# EAGLE design ne5044_emulator (EAGLE 9.2.0)
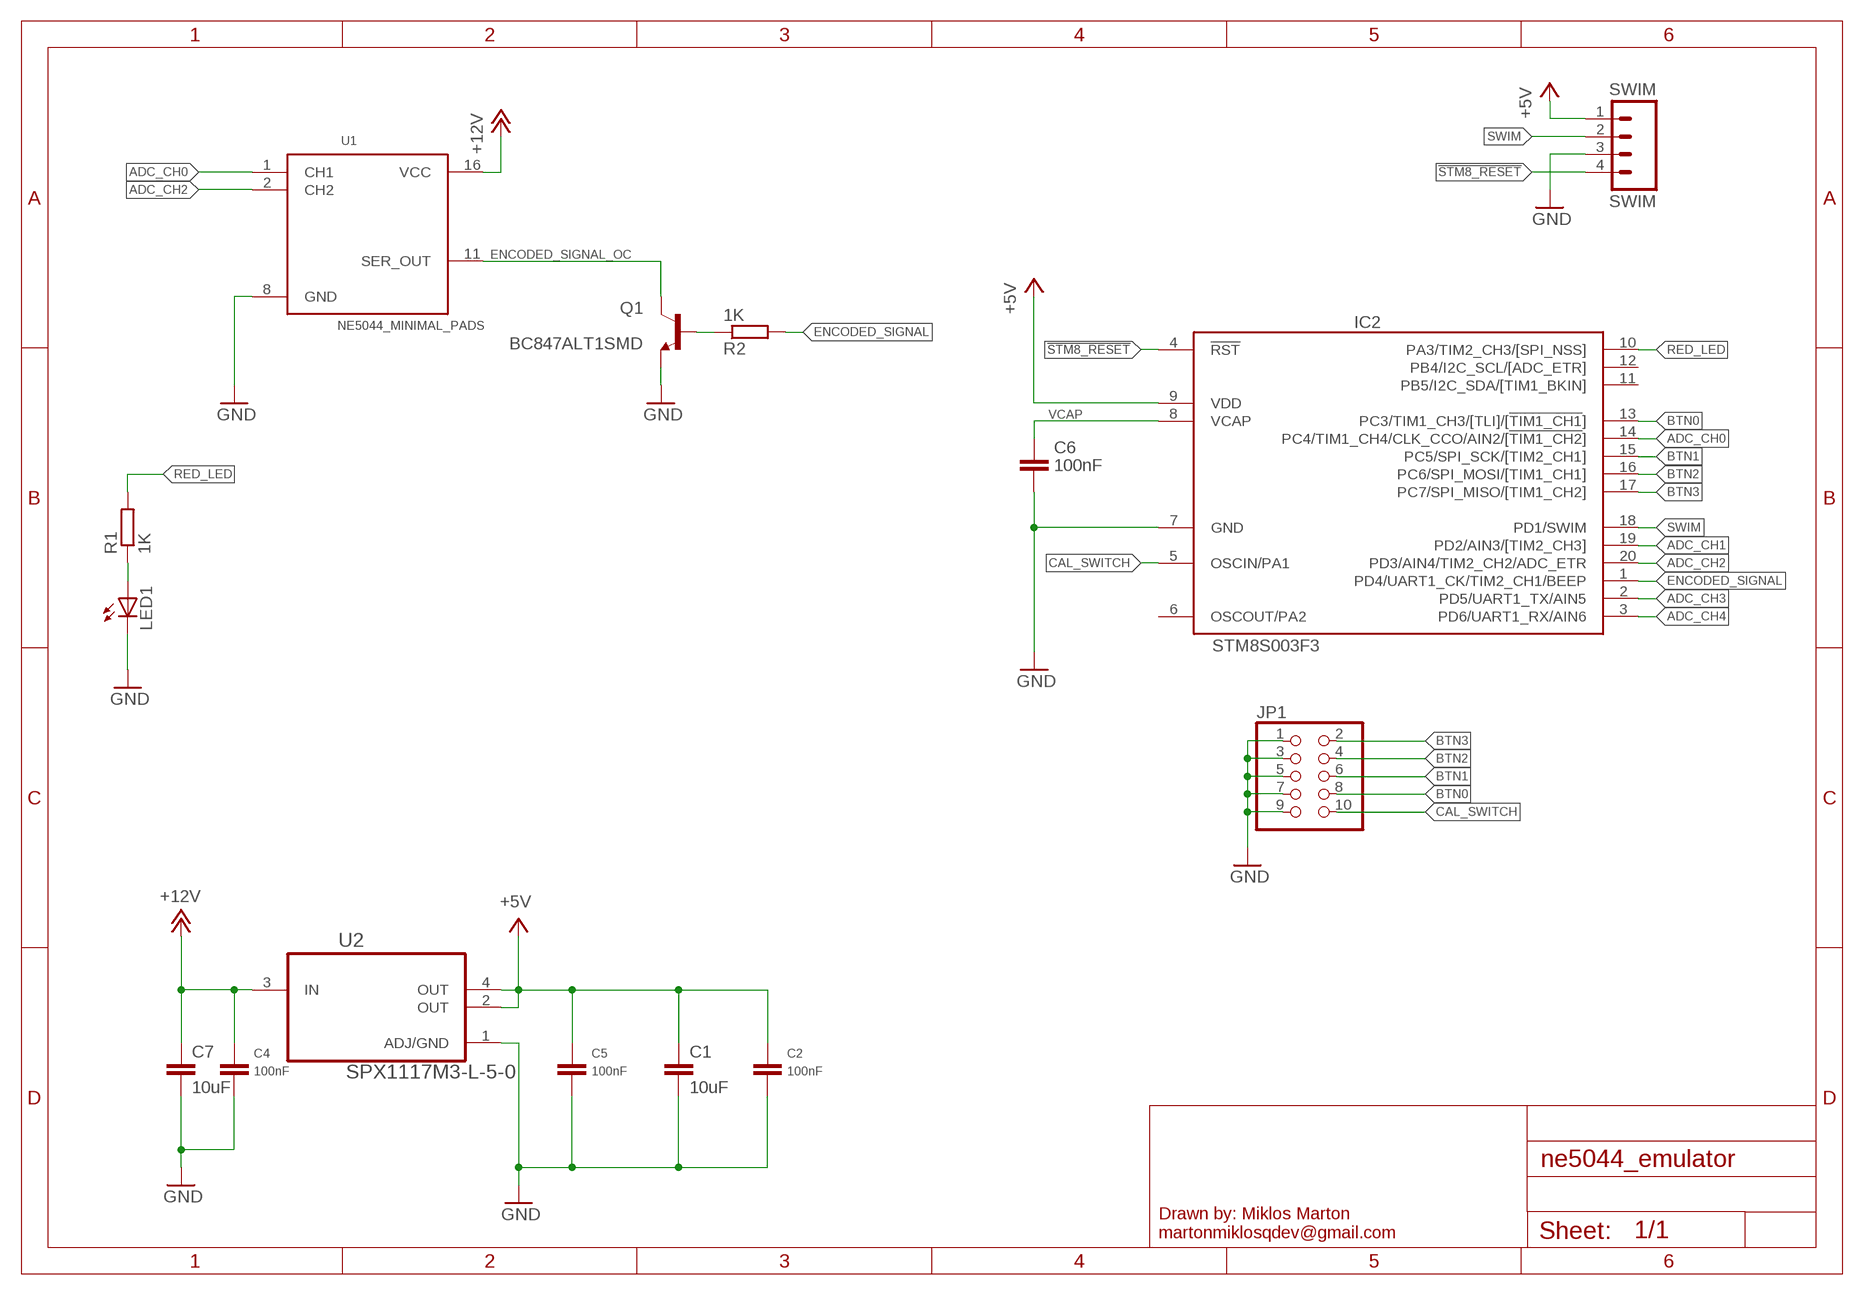
[diagram p0: schematic, sheet 1]

## Parts
C1  10uF  C-EUC0805  [C0805]
C2  100nF  C-EUC0603K  [C0603K]
C4  100nF  C-EUC0603K  [C0603K]
C5  100nF  C-EUC0603K  [C0603K]
C6  100nF  C-EUC0603  [C0603]
C7  10uF  C-EUC0805  [C0805]
IC2  STM8S003F3  [TSSOP20]
JP1  PINHD-2X5  [2X05]
LED1  LEDCHIP-LED0603  [CHIP-LED0603]
Q1  BC847ALT1SMD  [SOT23]
R1  1K  R-EU_R0603  [R0603]
R2  1K  R-EU_R0603  [R0603]
SWIM  SWIM  M041.27MM  [1X04-1.27MM]
U1  NE5044_MINIMAL_PADS  [DIL16_MINIMAL_PADS_FOR_NE5044]
U2  SPX1117M3-L-5-0  LM1117MP-ADJ  [SOT230P696X180-4N]

## Nets
!STM8_RESET: IC2.4(!RST) SWIM.4
+5V: C1.1 C2.1 C5.1 IC2.9(VDD) SWIM.1 U2.2(OUT) U2.4(OUT)
+12V: C4.1 C7.1 U1.16(VCC) U2.3(IN)
ADC_CH0: IC2.14(PC4/TIM1_CH4/CLK_CCO/AIN2/[!TIM1_CH2!]) U1.1(CH1)
ADC_CH1: IC2.19(PD2/AIN3/[TIM2_CH3])
ADC_CH2: IC2.20(PD3/AIN4/TIM2_CH2/ADC_ETR) U1.2(CH2)
ADC_CH3: IC2.2(PD5/UART1_TX/AIN5)
ADC_CH4: IC2.3(PD6/UART1_RX/AIN6)
BTN0: IC2.13(PC3/TIM1_CH3/[TLI]/[!TIM1_CH1!]) JP1.8
BTN1: IC2.15(PC5/SPI_SCK/[TIM2_CH1]) JP1.6
BTN2: IC2.16(PC6/SPI_MOSI/[TIM1_CH1]) JP1.4
BTN3: IC2.17(PC7/SPI_MISO/[TIM1_CH2]) JP1.2
CAL_SWITCH: IC2.5(OSCIN/PA1) JP1.10
ENCODED_SIGNAL: IC2.1(PD4/UART1_CK/TIM2_CH1/BEEP) R2.2
ENCODED_SIGNAL_OC: Q1.3(C) U1.11(SER_OUT)
GND: C1.2 C2.2 C4.2 C5.2 C6.2 C7.2 IC2.7(GND) JP1.1 JP1.3 JP1.5 JP1.7 JP1.9 LED1.C Q1.2(E) SWIM.3 U1.8(GND) U2.1(ADJ/GND)
N$1: LED1.A R1.1
N$2: Q1.1(B) R2.1
RED_LED: IC2.10(PA3/TIM2_CH3/[SPI_NSS]) R1.2
SWIM: IC2.18(PD1/SWIM) SWIM.2
VCAP: C6.1 IC2.8(VCAP)
Unconnected: IC2.6(OSCOUT/PA2) IC2.11(PB5/I2C_SDA/[TIM1_BKIN]) IC2.12(PB4/I2C_SCL/[ADC_ETR])

## Library data of the parts
C1 C7 = rcl:C-EU: CAPACITOR, European symbol
C2 C4-C6 = rcl:C-EU: CAPACITOR, European symbol; OC_LOMEX: 82-06-23
IC2 = stm8:STM8S003: Value line, 16 MHz STM8S 8-bit MCU, 8 Kbytes Flash, 128 bytes data EEPROM, 10-bit ADC, 3 timers, UART, SPI, I2C
JP1 = pinhead:PINHD-2X5: PIN HEADER
LED1 = led:LED: LED OSRAM: - CHIPLED LG R971, LG N971, LY N971, LG Q971, LY Q971, LO R971, LY R971 LH N974, LH R974 LS Q976, LO Q976, LY Q976 LO Q996 - Hyper CHIPLED LW Q18S LB Q993, LB Q99A, LB R99A - SideLED LS A670, LO A670, LY A670, LG A670, LP A670 LB A673, LV A673, LT A673, LW A673 LH A674 LY A675 LS A676, LA A676, LO A676, LY A676, LW A676 LS A679, LY A679, LG A679 - Hyper Micro SIDELED® LS Y876, LA Y876, LO Y876, LY Y876 LT Y87S - SmartLED LW L88C, LW L88S LB L89C, LB L89S, LG L890 LS L89K, LO L89K, LY L89K LS L896, LA L896, LO L896, LY L896 - TOPLED LS T670, LO T670, LY T670, LG T670, LP T670 LSG T670, LSP T670, LSY T670, LOP T670, LYG T670 LG T671, LOG T671, LSG T671 LB T673, LV T673, LT T673, LW T673 LH T674 LS T676, LA T676, LO T676, LY T676, LB T676, LH T676, LSB T676, LW T676 LB T67C, LV T67C, LT T67C, LS T67K, LO T67K, LY T67K, LW E67C LS E67B, LA E67B, LO E67B, LY E67B, LB E67C, LV E67C, LT E67C LW T67C LS T679, LY T679, LG T679 LS T770, LO T770, LY T770, LG T770, LP T770 LB T773, LV T773, LT T773, LW T773 LH T774 LS E675, LA E675, LY E675, LS T675 LS T776, LA T776, LO T776, LY T776, LB T776 LHGB T686 LT T68C, LB T68C - Hyper Mini TOPLED® LB M676 - Mini TOPLED Santana® LG M470 LS M47K, LO M47K, LY M47K Source: http://www.osram.convergy.de LUXEON: - LUMILED® LXK2-PW12-R00, LXK2-PW12-S00, LXK2-PW14-U00, LXK2-PW14-V00 LXK2-PM12-R00, LXK2-PM12-S00, LXK2-PM14-U00 LXK2-PE12-Q00, LXK2-PE12-R00, LXK2-PE12-S00, LXK2-PE14-T00, LXK2-PE14-U00 LXK2-PB12-K00, LXK2-PB12-L00, LXK2-PB12-M00, LXK2-PB14-N00, LXK2-PB14-P00, LXK2-PB14-Q00 LXK2-PR12-L00, LXK2-PR12-M00, LXK2-PR14-Q00, LXK2-PR14-R00 LXK2-PD12-Q00, LXK2-PD12-R00, LXK2-PD12-S00 LXK2-PH12-R00, LXK2-PH12-S00 LXK2-PL12-P00, LXK2-PL12-Q00, LXK2-PL12-R00 Source: www.luxeon.com KINGBRIGHT: KA-3528ASYC Source: www.kingbright.com
Q1 = transistor-npn:BC847*: NPN Transistor
R1 R2 = rcl:R-EU_: RESISTOR, European symbol
SWIM = SparkFun:M04: Header 4 Standard 4-pin 0.1" header. Use with straight break away headers (SKU : PRT-00116), right angle break away headers (PRT-00553), swiss pins (PRT-00743), machine pins (PRT-00117), and female headers (PRT-00115). Molex polarized connector foot print use with SKU : PRT-08231 with associated crimp pins and housings. 1MM SMD Version SKU: PRT-10208
U1 = martonmiklos:NE5044_MINIMAL_PADS
U2 = NSC_By_element14_Batch_1.1:LM1117MP-ADJ: Linear regulators; MPN: LM1117MP-ADJ; OC_FARNELL: 9778187; OC_NEWARK: 13B5337; PACKAGE: SOT223-3; SUPPLIER: NationalSemiconductor

## Board
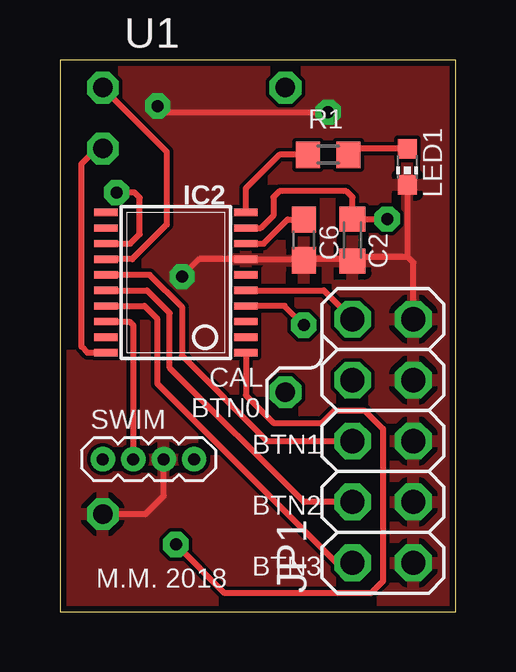
[diagram p1: board, top side]
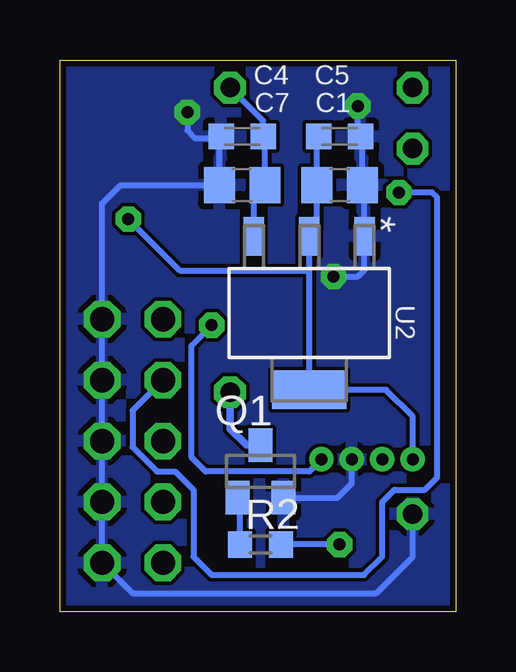
[diagram p2: board, bottom side, seen from below]

Size 16.5 x 23 mm. Coordinates in mm from the lower left corner, seen from the top.
Outline: 0,0 16.5,0 16.5,23 0,23 0,0
Copper layers (1*16): Top 0.035mm / dielectric 1.5mm / Bottom 0.035mm
Design rules "dirt_cheap_dirty_boards.v1": minimum track width 5mil, minimum drill 0.3mm, track to track 6mil, track to pad 6mil, pad to pad 6mil, via to via 6mil, smd to smd 0mil, copper to edge 10mil, drill to drill 10mil, minimum pad ring 10mil, minimum via ring 6mil, stop-mask expansion 2mil, vias tented up to drill 25mil, thermal gap 10mil

### Footprints (pad centres in the part's own frame; a part is rotated, then mirrored left to right if it is on the bottom)
C0805 = smd 1.3 x 1.5: 1 -0.95,0; 2 0.95,0
C0603K = smd 1.05 x 1.08: 1 -0.875,0; 2 0.875,0
C0603 = smd 1.1 x 1: 1 -0.85,0; 2 0.85,0
TSSOP20 = smd 0.305 x 0.991: 1 -2.925,-2.918; 2 -2.275,-2.918; 3 -1.625,-2.918; 4 -0.975,-2.918; 5 -0.325,-2.918; 6 0.325,-2.918; 7 0.975,-2.918; 8 1.625,-2.918; 9 2.275,-2.918; 10 2.925,-2.918; 11 2.925,2.918; 12 2.275,2.918; 13 1.625,2.918; 14 0.975,2.918; 15 0.325,2.918; 16 -0.325,2.918; 17 -0.975,2.918; 18 -1.625,2.918; 19 -2.275,2.918; 20 -2.925,2.918
2X05 = drill 1.016 octagon: 1 -5.08,-1.27; 2 -5.08,1.27; 3 -2.54,-1.27; 4 -2.54,1.27; 5 0,-1.27; 6 0,1.27; 7 2.54,-1.27; 8 2.54,1.27; 9 5.08,-1.27; 10 5.08,1.27
CHIP-LED0603 = smd 0.8 x 0.8: A 0,-0.75; C 0,0.75
SOT23 = smd 1 x 1.4: 1 -0.95,-1.1; 2 0.95,-1.1; 3 0,1.1
R0603 = smd 1 x 1.1: 1 -0.85,0; 2 0.85,0
1X04-1.27MM = drill 0.508 pad 1: 1 0,0; 2 1.27,0; 3 2.54,0; 4 3.81,0
DIL16_MINIMAL_PADS_FOR_NE5044 = drill 0.813 octagon: 1 -8.89,-3.81; 2 -6.35,-3.81; 8 8.89,-3.81; 11 3.81,3.81; 16 -8.89,3.81
SOT230P696X180-4N = smd 1.6 x 0.838: 1 -3.2,2.311; 2 -3.2,0; 3 -3.2,-2.311 | smd 1.6 x 3.099: 4 3.2,0

### Placement (x,y rotation side)
C1  4.83,17.78 0 bottom
C2  12.2,15.49 270 top
C4  8.9,19.81 180 bottom
C5  4.83,19.81 0 bottom
C6  10.17,15.49 270 top
C7  8.9,17.78 180 bottom
IC2  4.83,13.72 90 top
JP1  13.47,7.11 90 top
LED1  14.49,18.54 180 top
Q1  8.14,5.84 0 bottom
R1  11.18,19.05 180 top
R2  8.14,2.79 0 bottom
SWIM  1.79,6.35 0 top
U1  5.6,12.95 270 top
U2  6.1,12.45 270 bottom

### Tracks (layer width: path | path; a pad name or v marks a point on that pad's centre or on a via)
!STM8_RESET  (via drill 0.5 pad 1.05)
  Top 0.254: v10.17,11.94 9.37,12.74 IC2.4
  Bottom 0.254: v10.17,11.94 11.01,11.1 11.01,6.43 10.42,5.84 6.1,5.84 SWIM.4
+5V  (via drill 0.5 pad 1.05)
  Top 0.254: IC2.9 8.38,15.99 8.9,16.51 8.9,17.27 9.15,17.53 11.95,17.53 12.2,17.27 C2.1 v13.65,16.37
  Bottom 0.254: C5.1 5.78,19.74 C1.1 5.78,15.97 U2.2 6.1,14.22 | 6.1,14.22 U2.4 2.9,9.25 1.79,8.13 SWIM.1 | v13.65,16.37 11.5,14.22 6.1,14.22
+12V
  Bottom 0.254: U2.3 8.41,17.31 C7.1 7.95,19.74 C4.1 8.02,20.46 8.52,20.95 U1.16
ADC_CH0
  Top 0.254: U1.1 4.45,19.18 4.45,16.13 3.02,14.69 IC2.14
ADC_CH2
  Top 0.254: U1.2 1.53,19.3 0.9,18.67 0.9,11.05 1.16,10.79 IC2.20
BTN0  (via drill 0.5 pad 1.05)
  Top 0.254: v2.36,17.47 3.11,17.47 3.33,17.26 3.33,15.73 2.93,15.34 IC2.13
  Bottom 0.254: JP1.8 13.47,8.38 13.47,6.86 12.45,5.84 11.69,5.84 10.93,5.08 10.93,2.29 10.17,1.52 3.82,1.52 3.06,2.29 3.06,4.57 2.55,5.08 1.28,5.08 0.77,5.59 0.77,17.27 0.97,17.47 v2.36,17.47
BTN1
  Top 0.254: JP1.6 8.64,7.11 5.09,10.67 5.09,12.7 3.75,14.04 IC2.15
BTN2
  Top 0.254: JP1.4 10.17,4.57 4.58,10.16 4.58,12.45 3.63,13.39 | 3.63,13.39 | IC2.16 3.63,13.39
BTN3
  Top 0.254: JP1.2 11.54,2.03 4.07,9.5 4.07,12.19 3.52,12.74 IC2.17
CAL_SWITCH
  Top 0.254: JP1.10 11,13.39 IC2.5
ENCODED_SIGNAL  (via drill 0.5 pad 1.05)
  Top 0.254: IC2.1 7.75,9.02 8.9,7.87 10.93,7.87 11.44,8.38 12.71,8.38 13.47,7.62 13.47,1.27 12.96,0.76 6.87,0.76 v4.83,2.79
  Bottom 0.254: v4.83,2.79 R2.2
ENCODED_SIGNAL_OC
  Bottom 0.305: Q1.3 8.73,6.94 9.41,7.62 U1.11
GND  (via drill 0.5 pad 1.05)
  Top 0.254: 10.12,14.69 IC2.7 5.81,14.69 v5.09,13.97 | 10.12,14.69 C6.2 | 10.12,14.69 12.13,14.69 C2.2 12.38,14.8 14.49,14.8 | U1.8 3.56,4.06 4.33,4.83 SWIM.3 | JP1.9 14.74,14.54 14.49,14.8 | LED1.C 14.49,14.8 | v4.07,21.08 4.33,20.83 v11.18,20.83
  Bottom 0.254: 9.85,19.74 C7.2 13.98,17.78 14.74,17.02 JP1.9 JP1.7 JP1.5 JP1.3 JP1.1 13.47,0.76 3.31,0.76 1.79,2.29 U1.8 | 9.85,19.74 C4.2 | v5.09,13.97 4.07,13.97 3.79,14.25 U2.1 3.79,17.69 C1.2 3.88,19.74 C5.2 4.07,19.93 v4.07,21.08 | v11.18,20.83 11.18,20.07 10.86,19.74 9.85,19.74 | Q1.2 4.92,4.74 4.33,5.33 SWIM.3
  pour Bottom: 0,22.5 16.5,22.5 16.5,0 0,0
  pour Top: 0,23 16.5,23 16.5,0 0,0
N$1
  Top 0.254: LED1.A 12.28,19.29 R1.1
N$2
  Bottom 0.254: R2.1 8.99,4.64 Q1.1
RED_LED
  Top 0.254: R1.2 9.15,19.05 7.75,17.65 IC2.10
SWIM
  Top 0.254: SWIM.2 3.06,7.87 3.06,11.94 2.9,12.09 IC2.18
VCAP
  Top 0.254: IC2.8 8.49,15.34 9.49,16.34 C6.1

### Text on the board
tPlace: CAL | BTN0 | BTN1 | BTN2 | BTN3
tNames: M.M. 2018